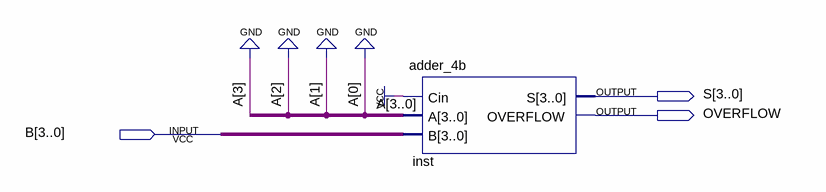
[diagram p0: schematic sheet]
// Quartus schematic inverter_4b.bdf as structural Verilog: 1 symbols, 3 pins
module inverter_4b (
  input  [3:0] B,
  output [3:0] S,
  output OVERFLOW
);

  adder_4b inst (.Cin(1'b1), .A(4'b0000), .B(B), .S(S), .OVERFLOW(OVERFLOW));
endmodule
